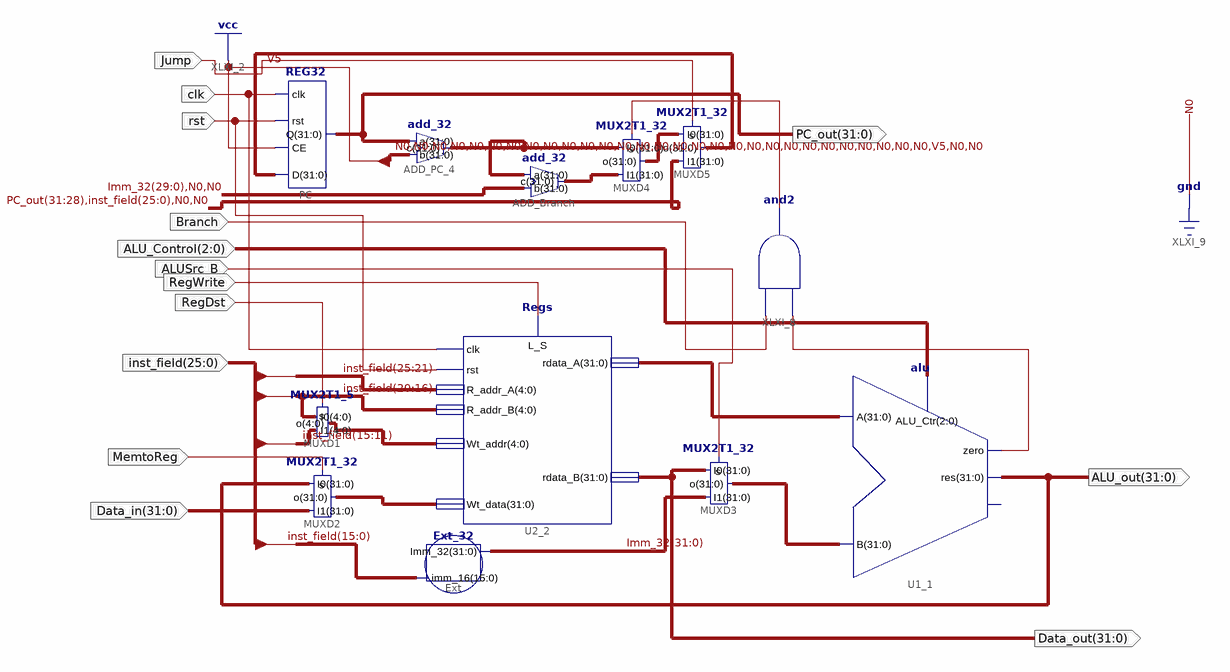
[diagram p0: schematic sheet 1]
// Xilinx ISE schematic Data_path.sch (kintex7) as structural Verilog: 12 symbols, 14 ports
module Data_path (
  input  clk,
  input  rst,
  input  Jump,
  input  Branch,
  input  [2:0] ALU_Control,
  input  ALUSrc_B,
  input  RegWrite,
  input  RegDst,
  input  [25:0] inst_field,
  input  MemtoReg,
  input  [31:0] Data_in,
  output [31:0] PC_out,
  output [31:0] Data_out,
  output [31:0] ALU_out
);

  wire XLXN_15, XLXN_23;
  wire [4:0] XLXN_35;
  wire [31:0] Imm_32, pc_4, XLXN_10, XLXN_14, XLXN_16, XLXN_27, XLXN_28, XLXN_36;

  REG32 PC (.D(XLXN_10), .CE(1'b1), .rst(rst), .clk(clk), .Q(PC_out));
  add_32 ADD_PC_4 (.c(pc_4), .a(PC_out), .b(32'b00000000000000000000000000000100));
  add_32 ADD_Branch (.c(XLXN_14), .a(pc_4), .b({Imm_32[29:0], 2'b00}));
  MUX2T1_32 MUXD4 (.s(XLXN_15), .I0(pc_4), .I1(XLXN_14), .o(XLXN_16));
  MUX2T1_32 MUXD5 (.s(Jump), .I0(XLXN_16), .I1({PC_out[31:28], inst_field, 2'b00}), .o(XLXN_10));
  and XLXI_8 (XLXN_15, XLXN_23, Branch);
  MUX2T1_32 MUXD2 (.s(MemtoReg), .I0(ALU_out), .I1(Data_in), .o(XLXN_36));
  Regs #(.VeriModel("Regs")) U2_2 (
    .clk(clk), .L_S(RegWrite), .rdata_A(XLXN_28), .rst(rst), .Wt_data(XLXN_36), .rdata_B(Data_out),
    .R_addr_A(inst_field[25:21]), .R_addr_B(inst_field[20:16]), .Wt_addr(XLXN_35));
  MUX2T1_32 MUXD3 (.s(ALUSrc_B), .I0(Data_out), .I1(Imm_32), .o(XLXN_27));
  alu U1_1 (.ALU_Ctr(ALU_Control), .res(ALU_out), .zero(XLXN_23), .A(XLXN_28), .B(XLXN_27));  // open: overflow
  MUX2T1_5 MUXD1 (.I1(inst_field[15:11]), .I0(inst_field[20:16]), .o(XLXN_35), .s(RegDst));
  Ext_32 Ext (.imm_16(inst_field[15:0]), .Imm_32(Imm_32));
endmodule
